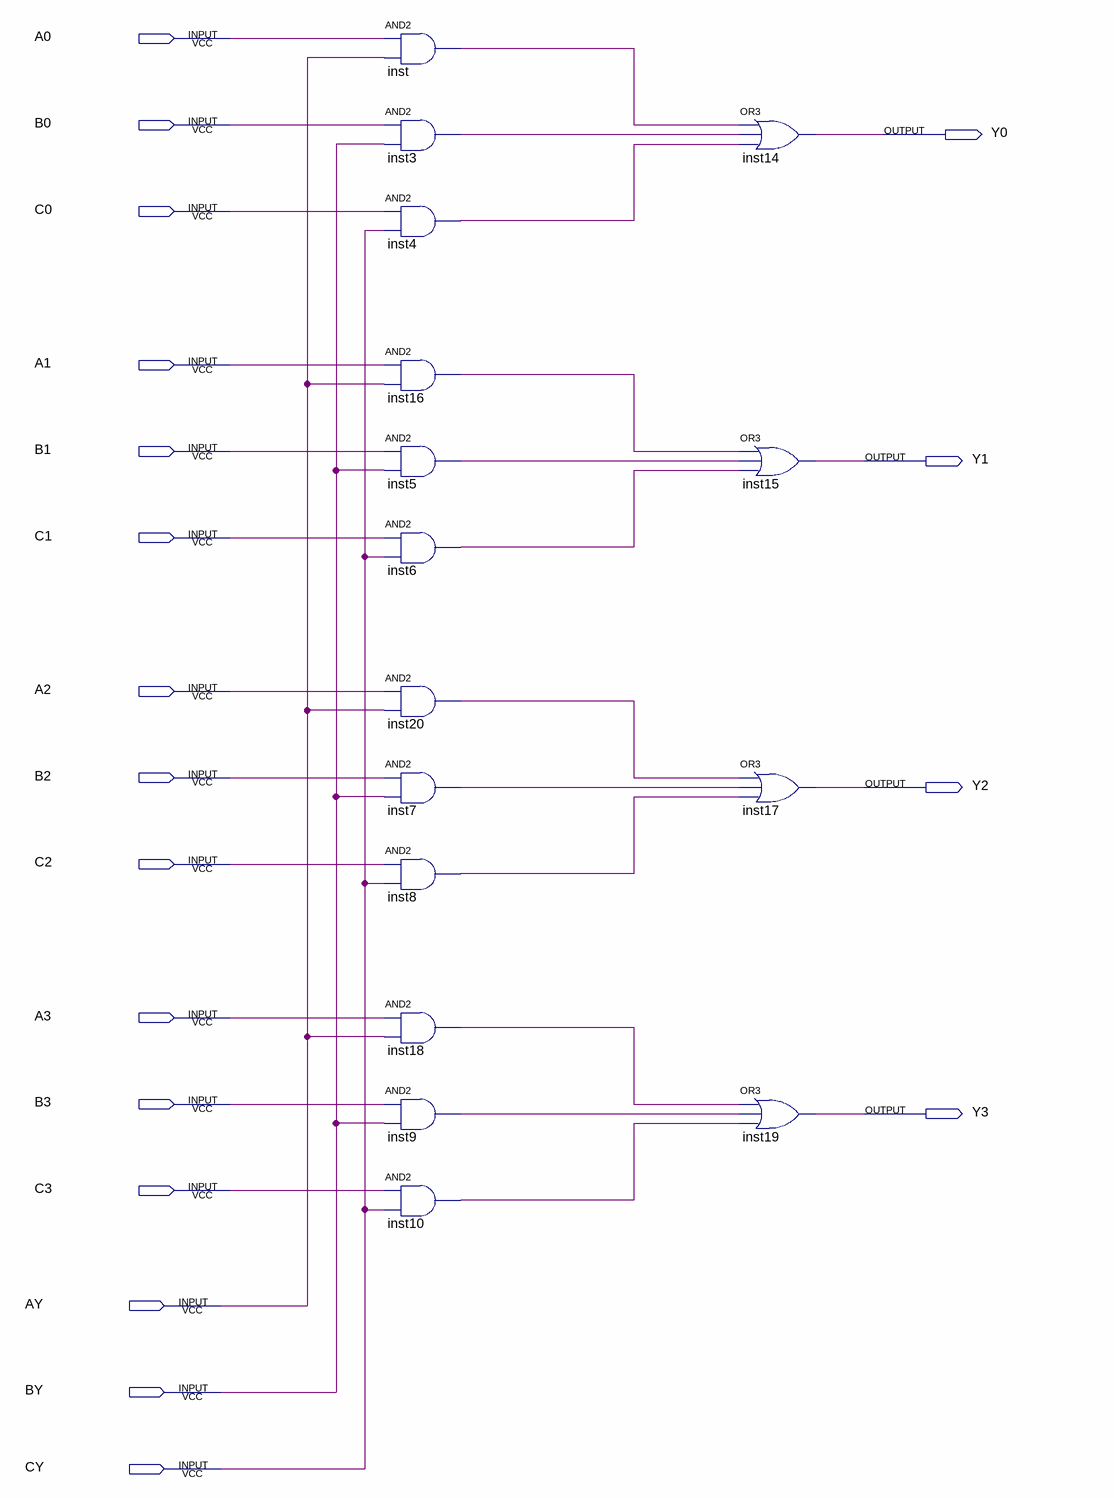
[diagram p0: schematic sheet]
// Quartus schematic multiplexer.bdf as structural Verilog: 16 symbols, 19 pins
module multiplexer (
  input  A0,
  input  B0,
  input  C0,
  input  A1,
  input  B1,
  input  C1,
  input  A2,
  input  B2,
  input  C2,
  input  A3,
  input  B3,
  input  C3,
  input  AY,
  input  BY,
  input  CY,
  output Y0,
  output Y1,
  output Y2,
  output Y3
);

  wire inst3_out, inst4_out, inst5_out, inst6_out, inst7_out, inst8_out, inst9_out, inst10_out, inst16_out,
       inst18_out, inst20_out, inst_out;

  and inst (inst_out, A0, AY);
  and inst3 (inst3_out, B0, BY);
  and inst4 (inst4_out, C0, CY);
  and inst16 (inst16_out, A1, AY);
  and inst5 (inst5_out, B1, BY);
  and inst6 (inst6_out, C1, CY);
  and inst20 (inst20_out, A2, AY);
  and inst7 (inst7_out, B2, BY);
  and inst8 (inst8_out, C2, CY);
  and inst18 (inst18_out, A3, AY);
  and inst9 (inst9_out, B3, BY);
  and inst10 (inst10_out, C3, CY);
  or inst14 (Y0, inst_out, inst3_out, inst4_out);
  or inst15 (Y1, inst16_out, inst5_out, inst6_out);
  or inst17 (Y2, inst20_out, inst7_out, inst8_out);
  or inst19 (Y3, inst18_out, inst9_out, inst10_out);
endmodule
